# Altium schematic sheet nRF_Board.SchDoc: Communication board
size Letter; DrawnBy: Simon Bouchard
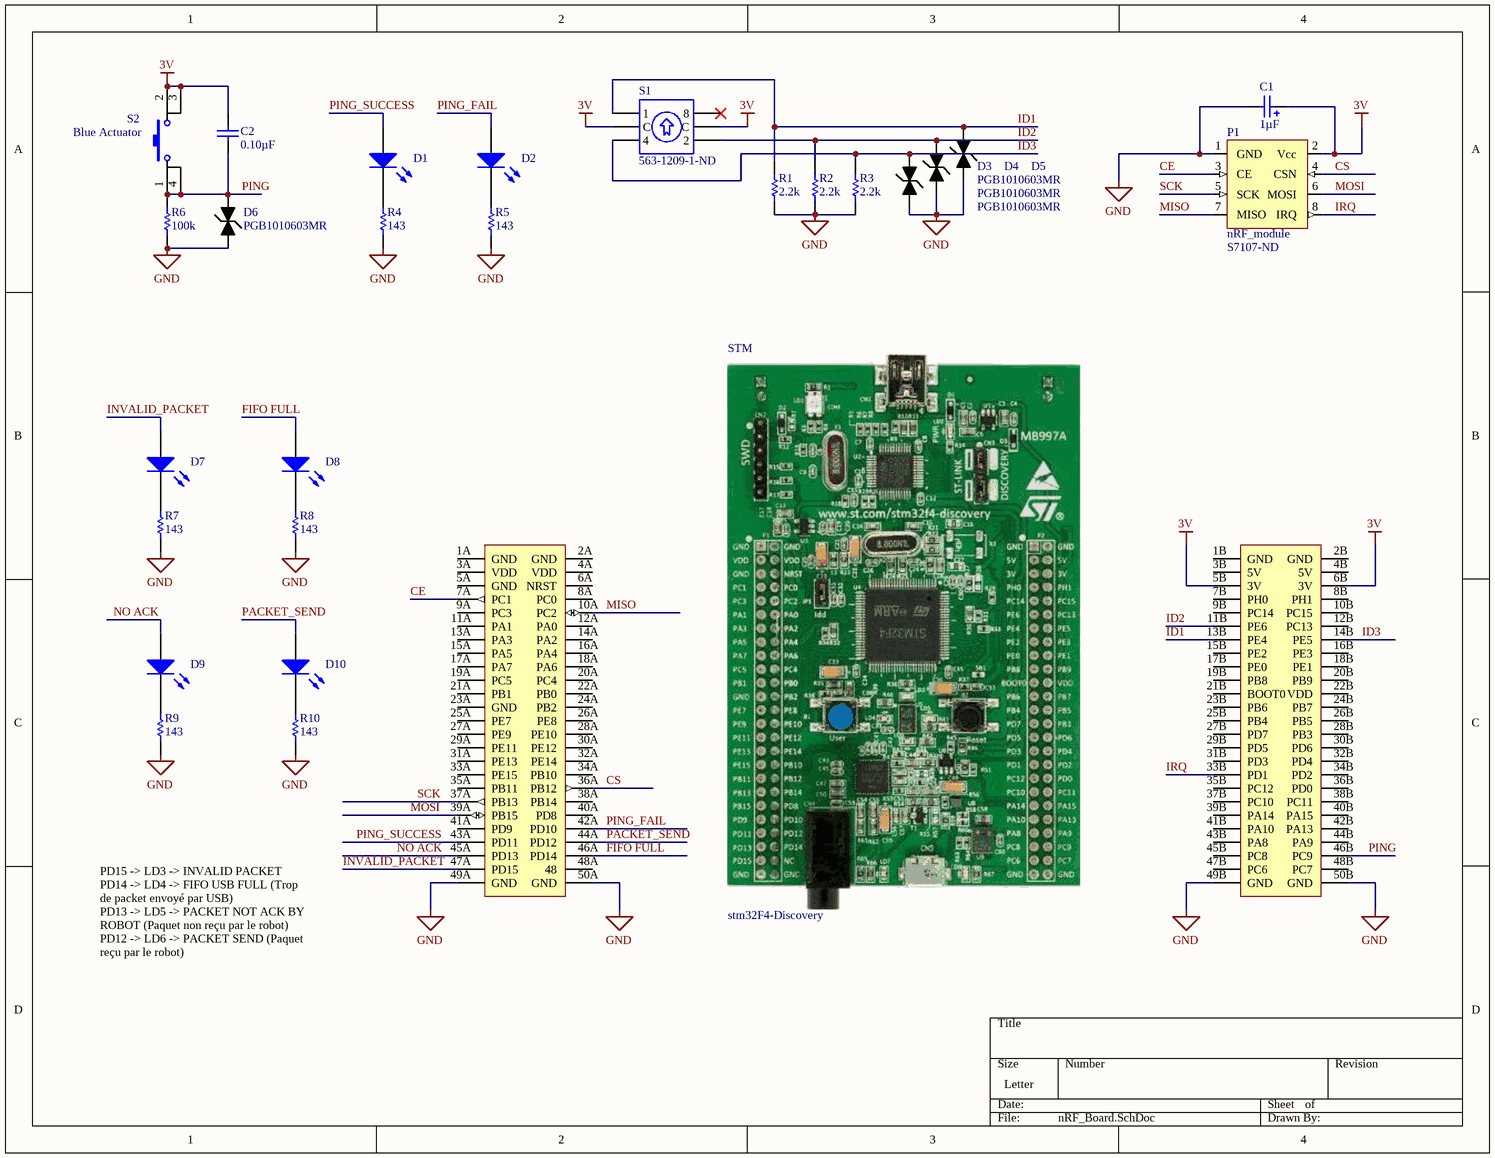
[diagram p0: nRF_Board.SchDoc]

## Parts
C1  Capacitance: 1µF  [CAP 4.3x4.3mm]  (hidden comment: 865060640001)
C2  Capacitance: 0.10µF  [0603]  (hidden comment: CL10B104KB8SFNC)
D1  LG R971-KN-1  [0805]  (value not drawn)
D2  LG R971-KN-1  [0805]  (value not drawn)
D3  PGB1010603MR  [0603]
D4  PGB1010603MR  [0603]
D5  PGB1010603MR  [0603]
D6  PGB1010603MR  [0603]
D7  LG R971-KN-1  [0805]  (value not drawn)
D8  LG R971-KN-1  [0805]  (value not drawn)
D9  LG R971-KN-1  [0805]  (value not drawn)
D10  LG R971-KN-1  [0805]  (value not drawn)
P1  nRF_module  Supplier Part Number 1: S7107-ND  [nRF_connector]
R1  Resistance (Ohms): 2.2k  [0603]  (hidden comment: RC0603FR-072K2L)
R2  Resistance (Ohms): 2.2k  [0603]  (hidden comment: RC0603FR-072K2L)
R3  Resistance (Ohms): 2.2k  [0603]  (hidden comment: RC0603FR-072K2L)
R4  Resistance (Ohms): 143  [0603]  (hidden comment: RC0603FR-07143RL)
R5  Resistance (Ohms): 143  [0603]  (hidden comment: RC0603FR-07143RL)
R6  Resistance (Ohms): 100k  [0603]  (hidden comment: RC0603JR-07100KL)
R7  Resistance (Ohms): 143  [0603]  (hidden comment: RC0603FR-07143RL)
R8  Resistance (Ohms): 143  [0603]  (hidden comment: RC0603FR-07143RL)
R9  Resistance (Ohms): 143  [0603]  (hidden comment: RC0603FR-07143RL)
R10  Resistance (Ohms): 143  [0603]  (hidden comment: RC0603FR-07143RL)
S1  Supplier Part Number 1: 563-1209-1-ND  [RotarySwitch]  (hidden comment: SH-7010TB)
S2  Features: Blue Actuator  [6 mm Tact Switches]  (hidden comment: PTS645SM43SMTR92 LFS)
STM  stm32F4-Discovery  [stm32-discovery]

## Nets
3V: C1.1 C2.2 P1.2(Vcc) S1.2(C) S1.5(C) S2.2 S2.3 STM.5B(3V) STM.6B(3V)
GND: C1.2 D3.1 D4.1 D5.1 D6.1 P1.1(GND) R1.1 R2.1 R3.1 R4.1 R5.1 R6.1 R7.1 R8.1 R9.1 R10.1 STM.49A(GND) STM.49B(GND) STM.50A(GND) STM.50B(GND)
CE: P1.3(CE) STM.7A(PC1)
CS: P1.4(CSN) STM.36A(PB12)
FIFO FULL: D8.1(A) STM.46A(PD14)
ID1: D3.2 R1.2 S1.1 STM.13B(PE4)
ID2: D5.2 R2.2 S1.4(2) STM.11B(PE6)
ID3: D4.2 R3.2 S1.3(4) STM.14B(PE5)
INVALID_PACKET: D7.1(A) STM.47A(PD15)
IRQ: P1.8(IRQ) STM.33B(PD1)
MISO: P1.7(MISO) STM.10A(PC2)
MOSI: P1.6(MOSI) STM.39A(PB15)
NO ACK: D9.1(A) STM.45A(PD13)
PACKET_SEND: D10.1(A) STM.44A(PD12)
PING: C2.1 D6.2 R6.2 S2.1 S2.4 STM.46B(PC9)
PING_FAIL: D2.1(A) STM.42A(PD10)
PING_SUCCESS: D1.1(A) STM.43A(PD11)
SCK: P1.5(SCK) STM.37A(PB13)
NetD1_2: D1.2(K) R4.2
NetD2_2: D2.2(K) R5.2
NetD7_2: D7.2(K) R7.2
NetD8_2: D8.2(K) R8.2
NetD9_2: D9.2(K) R9.2
NetD10_2: D10.2(K) R10.2

Not connected (* = marked no-connect by the designer): S1 6(8)*; STM 1A(GND) 1B(GND) 2A(GND) 2B(GND) 3A(VDD) 3B(5V) 4A(VDD) 4B(5V) 5A(GND) 6A(NRST) 7B(PH0) 8A(PC0) 8B(PH1) 9A(PC3) 9B(PC14) 10B(PC15) 11A(PA1) 12A(PA0) 12B(PC13) 13A(PA3) 14A(PA2) 15A(PA5) 15B(PE2) 16A(PA4) 16B(PE3) 17A(PA7) 17B(PE0) 18A(PA6) 18B(PE1) 19A(PC5) 19B(PB8) 20A(PC4) 20B(PB9) 21A(PB1) 21B(BOOT0) 22A(PB0) 22B(VDD) 23A(GND) 23B(PB6) 24A(PB2) 24B(PB7) 25A(PE7) 25B(PB4) 26A(PE8) 26B(PB5) 27A(PE9) 27B(PD7) 28A(PE10) 28B(PB3) 29A(PE11) 29B(PD5) 30A(PE12) 30B(PD6) 31A(PE13) 31B(PD3) 32A(PE14) 32B(PD4) 33A(PE15) 34A(PB10) 34B(PD2) 35A(PB11) 35B(PC12) 36B(PD0) 37B(PC10) 38A(PB14) 38B(PC11) 39B(PA14) 40A(PD8) 40B(PA15) 41A(PD9) 41B(PA10) 42B(PA13) 43B(PA8) 44B(PA9) 45B(PC8) 47B(PC6) 48A(48) 48B(PC7)

## Notes on the sheet
- PD15 -> LD3 -> INVALID PACKET
  PD14 -> LD4 -> FIFO USB FULL (Trop de packet envoyé par USB)
  PD13 -> LD5 -> PACKET NOT ACK BY ROBOT (Paquet non reçu par le robot)
  PD12 -> LD6 -> PACKET SEND (Paquet reçu par le robot)

## Library data of the parts
C1 = 865060640001: CAP 1 UF 20% 50 V; Manufacturer: Wurth Electronics Inc; Voltage Rating: 50V; Lifetime @ Temp.: 2000 Hrs @ 105°C; Polarization: Polar; Ripple Current: 60mA @ 100kHz; Impedance: 2.9 Ohm; Surface Mount Land Size: 0.169" L x 0.169" W (4.30mm x 4.30mm); Supplier 1: Digi-Key; Manufacturer Part Number: 865060640001; RoHS: RoHS Compliant; Category: Capacitors; Stock 1: 1635; Pricing 1: 1=0.24, 50=0.201, 100=0.175, 250=0.1556, 500=0.13616, 1000=0.12967 (CAD); Packaging: Cut Tape (CT); Tolerance: ±20%; ESR (Equivalent Series Resistance): -; Operating Temperature: -55°C ~ 105°C; Applications: General Purpose; Lead Spacing: -; Size / Dimension: 0.157" Dia (4.00mm); Height - Seated (Max): 0.217" (5.50mm); Mounting Type: Surface Mount; Package / Case: Radial, Can - SMD; ComponentLink1URL: http://katalog.we-online.de/pbs/datasheet/865060640001.pdf; ComponentLink1Description: http://katalog.we-online.de/pbs/datasheet/865060640001.pdf; Supplier Part Number 1: 732-8541-1-ND
C2 = CL10B104KB8SFNC: CAP CER 0.1UF 50V X7R 0603; Manufacturer: Samsung Electro-Mechanics America, Inc.; Tolerance: ±10%; Supplier 1: Digi-Key; Manufacturer Part Number: CL10B104KB8SFNC; RoHS: RoHS Compliant; Category: Capacitors; Packaging: Cut Tape (CT); Voltage - Rated: 50V; Temperature Coefficient: X7R; Mounting Type: Surface Mount, MLCC; Operating Temperature: -55°C ~ 125°C; Applications: Boardflex Sensitive; Ratings: -; Package / Case: 0603 (1608 Metric); Size / Dimension: 0.063" L x 0.031" W (1.60mm x 0.80mm); Height - Seated (Max): -; Thickness (Max): 0.035" (0.90mm); Lead Spacing: -; Features: Soft Termination; Lead Style: -; ComponentLink1URL: http://www.samsungsem.com/kr/support/product-search/mlcc/CL10B104KB8SFNC.jsp; ComponentLink1Description: http://www.samsungsem.com/kr/support/product-search/mlcc/CL10B104KB8SFNC.jsp; Supplier Part Number 1: 490-1519-1-ND
D1 D2 D7-D10 = LG R971-KN-1: LED GREEN DIFFUSED 0805 SMD; Manufacturer: OSRAM Opto Semiconductors Inc.; Lens Color: White; Millicandela Rating: 26.05mcd; Lens Style/Size: Rectangle with Flat Top, 1.30mm x 1.25mm; Voltage - Forward (Vf) (Typ): 2.2V; Current - Test: 20mA; Viewing Angle: 160°; Wavelength - Dominant: 570nm; Wavelength - Peak: 572nm; Supplier 1: Digi-Key; Manufacturer Part Number: LG R971-KN-1; RoHS: RoHS Compliant; Category: Optoelectronics; Stock 1: 315869; Pricing 1: 1=0.37, 10=0.267, 25=0.1972, 100=0.141, 250=0.09588, 500=0.0846, 1000=0.06626 (CAD); Packaging: Cut Tape (CT); Lens Transparency: Diffused; Mounting Type: Surface Mount; Features: -; Package / Case: 0805 (2012 Metric); Supplier Device Package: *; Size / Dimension: 2.00mm L x 1.25mm W; Height (Max): 0.90mm; ComponentLink1URL: http://www.osram-os.com/Graphics/XPic9/00078860_0.pdf; ComponentLink1Description: http://www.osram-os.com/Graphics/XPic9/00078860_0.pdf
D3-D6 = PGB1010603MR: TVS DIODE 24VWM 150VC 0603; Supplier 1: Digi-Key; Supplier Part Number 1: F2594CT-ND
P1 = nRF_module: 2x4 100mil header; Supplier 1: Digi-Key
R1-R3 = RC0603FR-072K2L: RES SMD 2.2K OHM 1% 1/10W 0603; Manufacturer: Yageo; Power (Watts): 0.1W, 1/10W; Temperature Coefficient: ±100ppm/°C; Supplier 1: Digi-Key; Manufacturer Part Number: RC0603FR-072K2L; RoHS: RoHS Compliant; Category: Resistors; Stock 1: 297758; Pricing 1: 1=0.15, 10=0.021, 25=0.0152, 100=0.0086, 250=0.0066, 500=0.00526, 1000=0.00389, 2500=0.00337 (CAD); Packaging: Cut Tape (CT); Tolerance: ±1%; Composition: Thick Film; Features: Moisture Resistant; Operating Temperature: -55°C ~ 155°C; Package / Case: 0603 (1608 Metric); Supplier Device Package: 0603; Size / Dimension: 0.063" L x 0.031" W (1.60mm x 0.80mm); Height: 0.022" (0.55mm); Number of Terminations: 2; ComponentLink1URL: http://www.yageo.com/documents/recent/PYu-RC_Group_51_RoHS_L_04.pdf; ComponentLink1Description: http://www.yageo.com/documents/recent/PYu-RC_Group_51_RoHS_L_04.pdf; Supplier Part Number 1: 311-2.20KHRCT-ND
R4 R5 R7-R10 = RC0603FR-07143RL: RES SMD 143 OHM 1% 1/10W 0603; Manufacturer: Yageo; Power (Watts): 0.1W, 1/10W; Temperature Coefficient: ±100ppm/°C; Supplier 1: Digi-Key; Manufacturer Part Number: RC0603FR-07143RL; RoHS: RoHS Compliant; Category: Resistors; Stock 1: 63239; Pricing 1: 1=0.15, 10=0.021, 25=0.0152, 100=0.0086, 250=0.0066, 500=0.00526, 1000=0.00389, 2500=0.00337 (CAD); Packaging: Cut Tape (CT); Tolerance: ±1%; Composition: Thick Film; Features: Moisture Resistant; Operating Temperature: -55°C ~ 155°C; Package / Case: 0603 (1608 Metric); Supplier Device Package: 0603; Size / Dimension: 0.063" L x 0.031" W (1.60mm x 0.80mm); Height: 0.022" (0.55mm); Number of Terminations: 2; ComponentLink1URL: http://www.yageo.com/documents/recent/PYu-RC_Group_51_RoHS_L_04.pdf; ComponentLink1Description: http://www.yageo.com/documents/recent/PYu-RC_Group_51_RoHS_L_04.pdf; Supplier Part Number 1: 311-143HRCT-ND
R6 = RC0603JR-07100KL: RES SMD 100K OHM 5% 1/10W 0603; Manufacturer: Yageo; Power (Watts): 0.1W, 1/10W; Temperature Coefficient: ±100ppm/°C; Supplier 1: Digi-Key; Manufacturer Part Number: RC0603JR-07100KL; RoHS: RoHS Compliant; Category: Resistors; Stock 1: 2803334; Pricing 1: 1=0.15, 10=0.017, 25=0.012, 100=0.0067, 250=0.00508, 500=0.00408, 1000=0.003, 2500=0.0026 (CAD); Packaging: Cut Tape (CT); Tolerance: ±5%; Composition: Thick Film; Features: Moisture Resistant; Operating Temperature: -55°C ~ 155°C; Package / Case: 0603 (1608 Metric); Supplier Device Package: 0603; Size / Dimension: 0.063" L x 0.031" W (1.60mm x 0.80mm); Height: 0.022" (0.55mm); Number of Terminations: 2; ComponentLink1URL: http://www.yageo.com/documents/recent/PYu-RC_Group_51_RoHS_L_04.pdf; ComponentLink1Description: http://www.yageo.com/documents/recent/PYu-RC_Group_51_RoHS_L_04.pdf; Supplier Part Number 1: 311-100KGRCT-ND
S1 = SH-7010TB: SWITCH ROTARY DIP BCD 100MA 5V; Manufacturer: Copal Electronics Inc.; Number of Positions: 10; Voltage Rating: 5VDC; Actuator Type: Rotary for Tool; Actuator Level: Flush, Recessed; Pitch: 0.100" (2.54mm), Full; Washable: Yes; Body Material: Polyphenylene Sulfide (PPS); Electrical Life: 10,000 Steps; Supplier 1: Digi-Key; Manufacturer Part Number: SH-7010TB; RoHS: RoHS Compliant; Category: Switches; Stock 1: 18527; Pricing 1: 1=2.91, 10=2.798, 25=2.554, 50=2.4326, 100=2.1893, 250=2.00688 (CAD); Packaging: Cut Tape (CT); Circuit: BCD; Current Rating: 100mA; Contact Material: Copper Alloy; Contact Finish: Gold; Height Above Board: 0.148" (3.75mm); Mounting Type: Surface Mount; Termination Style: Gull Wing; Features: -; Length: 0.287" (7.30mm); Operating Temperature: -40°C ~ 85°C; Mechanical Life: -; ComponentLink1URL: http://www.nidec-copal-electronics.com/e/catalog/switch/sh-7000.pdf; ComponentLink1Description: http://www.nidec-copal-electronics.com/e/catalog/switch/sh-7000.pdf
S2 = PTS645SM43SMTR92 LFS: SWITCH TACTILE SPST-NO 0.05A 12V; Manufacturer: C&K Components; Switch Function: Off-Mom; Contact Rating @ Voltage: 0.05A @ 12VDC; Actuator Type: Standard; Actuator Height off PCB, from Pins: 4.30mm; Actuator Orientation: Top Actuated; Outline: 6.00mm x 6.00mm; Illumination: Non-Illuminated; Operating Force: 160gf; Actuator Material: Polyamide (PA66), Nylon 6/6; Mechanical Life: 100,000 Cycles; Supplier 1: Digi-Key; Supplier Part Number 1: CKN9112CT-ND; Manufacturer Part Number: PTS645SM43SMTR92 LFS; RoHS: RoHS Compliant; Category: Switches; Stock 1: 189506; Pricing 1: 1=0.44, 10=0.425, 25=0.4108, 50=0.3958, 100=0.3737, 250=0.35176, 500=0.33708 (CAD); Packaging: Cut Tape (CT); Circuit: SPST-NO; Mounting Type: Surface Mount; Termination Style: Gull Wing; Illumination Voltage (Nominal): -; Illumination Type, Color: -; Ingress Protection: -; Switch Travel: -; Operating Temperature: -20°C ~ 60°C; ComponentLink1URL: http://media.digikey.com/pdf/Data%20Sheets/C&K/PTS645_Series.pdf; ComponentLink1Description: http://media.digikey.com/pdf/Data%20Sheets/C&K/PTS645_Series.pdf